# Altium schematic sheet USB.SchDoc
size 420 x 297 mm; Scale: 1:1; DocumentType: Схема электрическая принципиальная; FirstReferrence: АБВГ.123456.001
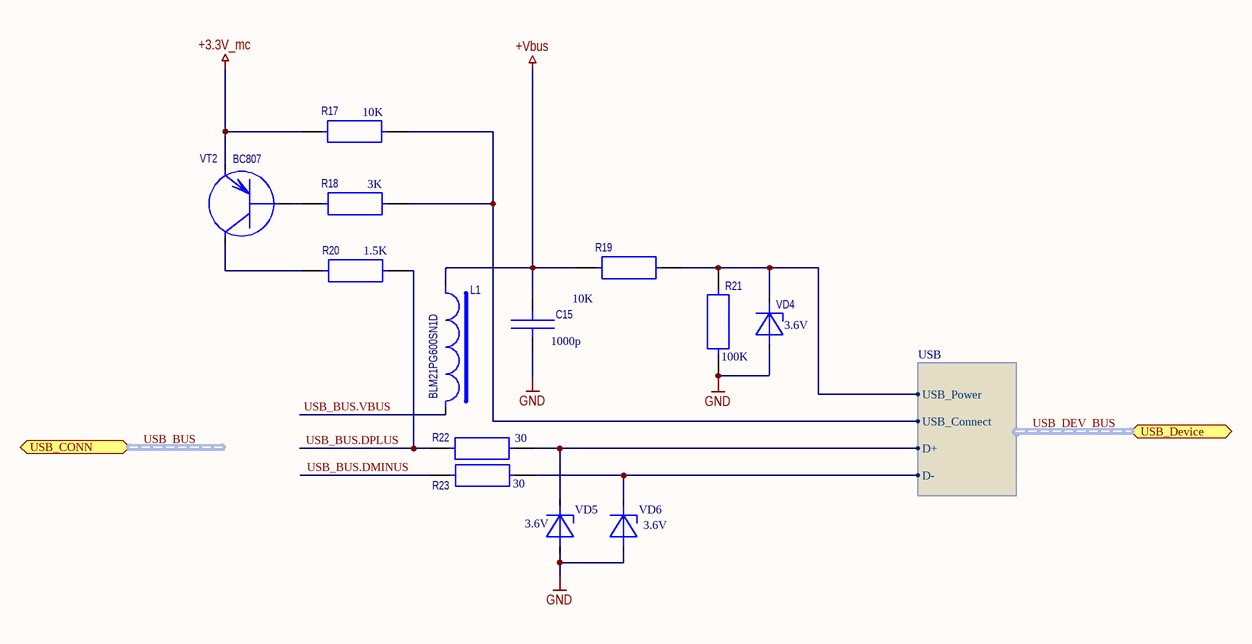
[diagram p0: USB.SchDoc]

## Parts
C15  1000p  [0603C]
L1  BLM21PG600SN1D  [0805]
R17  10K  [0603R]
R18  3K  [0603R]
R19  10K  [0603R]
R20  1.5K  [0603R]
R21  100K  [0603R]
R22  30  [0603R]
R23  30  [0603R]
VD4  value 3.6V  [SOT23_1DIODE]  (hidden comment: BZX84C3V6)
VD5  value 3.6V  [SOT23_1DIODE]  (hidden comment: BZX84C3V6)
VD6  value 3.6V  [SOT23_1DIODE]  (hidden comment: BZX84C3V6)
VT2  BC807  [SOT95P230X110-3L]

## Ports
USB_CONN (harness USB_connector), USB_Device (harness USB)

## Harnesses
USB: USB_Connect, USB_Power, D+, D-

## Nets
+3.3V_mc: R17.2 VT2.2(E)
+Vbus: C15.2 L1.1 R19.2
GND: C15.1 R21.1 VD4.A VD5.A VD6.A
USB_BUS.DMINUS: R23.1
USB_BUS.DPLUS: R20.1 R22.1
USB_BUS.VBUS: L1.2
USB_DEV_BUS.D+: R22.2 VD5.K ; port USB_Device.D+
USB_DEV_BUS.D-: R23.2 VD6.K ; port USB_Device.D-
USB_DEV_BUS.USB_Connect: R17.1 R18.1 ; port USB_Device.USB_Connect
USB_DEV_BUS.USB_Power: R19.1 R21.2 VD4.K ; port USB_Device.USB_Power
NetR18_2: R18.2 VT2.1(B)
NetR20_2: R20.2 VT2.3(C)

## Buses and harness runs
harness USB_BUS = port USB_CONN
harness USB_DEV_BUS = port USB_Device

## Notes on the sheet
- Подп. и дата
- Инв. № дубл.
- Взам. инв. №
- Инв. № подл.
- Изм.
- Лист
- № докум.
- Подп.
- Дата
- 2.106-A3
- Копировал
- Формат А3

## Library data of the parts
C15 = CAP: Конденсатор обыкновенный; Value: 1000p
L1 = INDUCTOR_: Индуктивность
R17-R23 = RES: Резистор обыкновенный
  R17 R19: Value: 10K
  R18: Value: 3K
  R20: Value: 1.5K
  R21: Value: 100K
  R22 R23: Value: 30
VD4-VD6 = ZENNER: Стабилитрон
VT2 = SOT32_PNP: Биполярный PNP транзистор